# EAGLE design main (EAGLE 7.7.0)
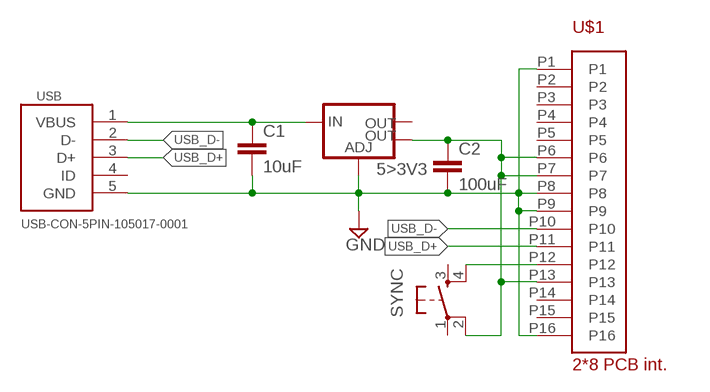
[diagram p0: schematic, sheet 1]

## Parts
5>3V3  V_REG_LM1117SOT223  [SOT223]
C1  10uF  C-EUC0805  [C0805]
C2  100uF  C-EUC0805  [C0805]
SYNC  TAC_SWITCHPTH  [TACTILE-PTH]
U$1  MOLEX_0541020164MOLEX  [MOLEX_0541020164]
USB  USB-CON-5PIN-105017-0001  [USB-MICRO-MOLEX-105017-0001]

## Nets
3V3: 5>3V3.4(OUT) C2.1 SYNC.2 U$1.P6 U$1.P7 U$1.P13
GND: 5>3V3.1(ADJ) C1.2 C2.2 U$1.P1 U$1.P8 U$1.P9 U$1.P16 USB.5(GND)
SYNC: SYNC.4 U$1.P12
USB_5V: 5>3V3.3(IN) C1.1 USB.1(VBUS)
USB_D+: U$1.P11 USB.3(D+)
USB_D-: U$1.P10 USB.2(D-)
Unconnected: 5>3V3.2(OUT) SYNC.1 SYNC.3 U$1.P2 U$1.P3 U$1.P4 U$1.P5 U$1.P14 U$1.P15 USB.4(ID)

## Library data of the parts
5>3V3 = SparkFun-PowerIC:V_REG_LM1117: Voltage Regulator LM1117 Standard adjustable voltage regulator but in SMD form. Spark Fun Electronics SKU : COM-00595; PROD_ID: VREG-08170
C1 C2 = rcl:C-EU: CAPACITOR, European symbol
SYNC = SparkFun-Retired:TAC_SWITCH: Momentary Switch Button commonly used for reset or general input. Spark Fun Electronics SKU : COM-00097 SMT- SWCH-08247
U$1 = wiiBL:MOLEX_0541020164
USB = GeekAmmo:USB-CON-5PIN: Molex Micro USB 105017-0001

## Board
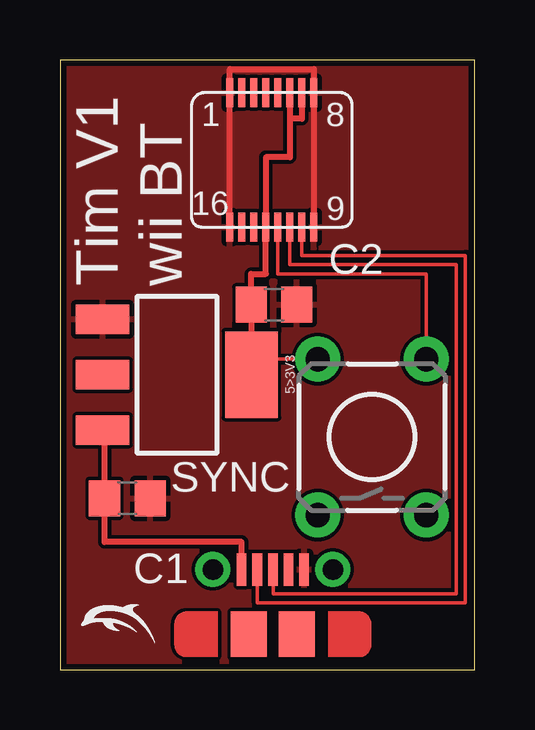
[diagram p1: board, top side]

Size 17.27 x 25.43 mm. Coordinates in mm from the lower left corner, seen from the top.
Outline: 17.27,0 17.27,25.43 0,25.43 0,0 17.27,0
Copper layers (1+2*3+16): Top 0.018mm / dielectric 0.36mm / layer 2 0.035mm / dielectric 0.71mm / layer 3 0.035mm / dielectric 0.36mm / Bottom 0.018mm
Design rules "eC_4Layer_PClass6_BaseCopperO18-I35_eCDefault": minimum track width 0.15mm, minimum drill 0.15mm, track to track 0.15mm, track to pad 0.15mm, pad to pad 0.15mm, via to via 0.15mm, smd to smd 0mil, copper to edge 0.25mm, drill to drill 0.35mm, minimum pad ring 0.175mm, minimum via ring 0.175mm, stop-mask expansion 0mil, vias tented up to drill 0.45mm, thermal gap 0.2mm

### Footprints (pad centres in the part's own frame; a part is rotated, then mirrored left to right if it is on the bottom)
SOT223 = smd 1.219 x 2.235: 1 -2.311,-3.099; 2 0,-3.099; 3 2.311,-3.099 | smd 3.6 x 2.2: 4 0,3.099
C0805 = smd 1.3 x 1.5: 1 -0.95,0; 2 0.95,0
TACTILE-PTH = drill 1.016 pad 1.88: 1 -3.251,2.261; 2 3.251,2.261; 3 -3.251,-2.261; 4 3.251,-2.261
MOLEX_0541020164 = smd 0.3 x 1.2: P1 0,5.6; P2 0.5,5.6; P3 1,5.6; P4 1.5,5.6; P5 2,5.6; P6 2.5,5.6; P7 3,5.6; P8 3.5,5.6; P9 3.5,0; P10 3,0; P11 2.5,0; P12 2,0; P13 1.5,0; P14 1,0; P15 0.5,0; P16 0,0
USB-MICRO-MOLEX-105017-0001 = smd 0.4 x 1.35: 1 1.2,0; 2 1.85,0; 3 2.5,0; 4 3.15,0; 5 3.8,0 | drill 0.85 pad 1.45: P$1 0,0; P$2 5,0 | smd 1.5 x 1.9: P$3 3.5,-2.7; P$4 1.5,-2.7

### Placement (x,y rotation side)
5>3V3  4.88,12.31 270 top
C1  2.81,7.15 0 top
C2  8.91,15.22 0 top
SYNC  13,9.7 90 top
U$1  7.07,18.46 0 top
USB  6.37,4.18 0 top

### Tracks (layer width: path | path; a pad name or v marks a point on that pad's centre or on a via)
3V3
  Top 0.152: 7.97,12.96 SYNC.2
  Top 0.254: U$1.P6 9.57,22.97 | 9.57,22.97 9.57,21.37 8.57,21.37 U$1.P13 8.57,16.51 7.96,16.51 C2.1 7.96,12.31 5>3V3.4 7.97,12.96 | U$1.P7 10.07,22.97 9.57,22.97
GND
  Top 0.254: U$1.P9 U$1.P8 10.57,25.05 7.07,25.05 U$1.P1 U$1.P16
  pour Top: 0,0 17.27,0 17.27,25.4 0,25.4
SYNC
  Top 0.152: SYNC.4 15.26,16.51 9.07,16.51 U$1.P12
USB_5V
  Top 0.254: USB.1 7.57,5.33 1.86,5.33 C1.1 1.86,9.99 5>3V3.3
USB_D+
  Top 0.152: U$1.P11 9.57,16.89 16.51,16.89 16.51,3.17 8.89,3.17 8.89,4.18
  Top 0.254: 8.89,4.18 USB.3
USB_D-
  Top 0.152: U$1.P10 10.07,17.27 16.89,17.27 16.89,2.79 8.22,2.79 USB.2

### Text on the board
tPlace: Tim V1 / wii BT | C:/Users/Tim/Downloads/dolphin-emu-clean.bmp